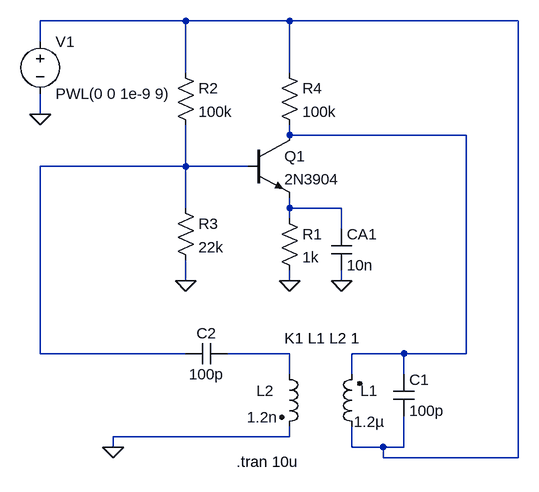
[diagram p0: schematic Barkhausen_ejemplo1_circuito.asc]
Barkhausen_ejemplo1_circuito.asc, the LTspice schematic file:
Version 4
SHEET 1 880 680
WIRE 48 -80 -176 -80
WIRE 208 -80 48 -80
WIRE 560 -80 208 -80
WIRE -176 -48 -176 -80
WIRE 48 0 48 -80
WIRE 208 0 208 -80
WIRE -176 64 -176 32
WIRE 208 96 208 80
WIRE 480 96 208 96
WIRE 48 144 48 80
WIRE 48 144 -176 144
WIRE 144 144 48 144
WIRE 48 208 48 144
WIRE 208 208 208 192
WIRE 288 208 208 208
WIRE 208 224 208 208
WIRE 288 240 288 208
WIRE 48 320 48 288
WIRE 208 320 208 304
WIRE 288 320 288 304
WIRE -176 432 -176 144
WIRE 48 432 -176 432
WIRE 208 432 112 432
WIRE 384 432 304 432
WIRE 480 432 480 96
WIRE 480 432 384 432
WIRE 208 464 208 432
WIRE 304 464 304 432
WIRE 384 464 384 432
WIRE 208 560 208 544
WIRE 208 560 -64 560
WIRE -64 576 -64 560
WIRE 304 576 304 544
WIRE 352 576 304 576
WIRE 384 576 384 528
WIRE 384 576 352 576
WIRE 352 592 352 576
WIRE 560 592 560 -80
WIRE 560 592 352 592
FLAG 208 320 0
FLAG 288 320 0
FLAG 48 320 0
FLAG -64 576 0
FLAG -176 64 0
SYMBOL npn 144 96 R0
SYMATTR InstName Q1
SYMATTR Value 2N3904
SYMBOL res 192 208 R0
SYMATTR InstName R1
SYMATTR Value 1k
SYMBOL cap 272 240 R0
SYMATTR InstName CA1
SYMATTR Value 10n
SYMBOL res 32 -16 R0
SYMATTR InstName R2
SYMATTR Value 100k
SYMBOL res 32 192 R0
SYMATTR InstName R3
SYMATTR Value 22k
SYMBOL cap 368 464 R0
SYMATTR InstName C1
SYMATTR Value 100p
SYMBOL ind2 320 560 R180
WINDOW 0 -24 71 Left 2
WINDOW 3 -34 23 Left 2
SYMATTR InstName L1
SYMATTR Value 1.2µ
SYMATTR Type ind
SYMBOL ind2 192 448 R0
WINDOW 0 -35 41 Left 2
WINDOW 3 -50 82 Left 2
SYMATTR InstName L2
SYMATTR Value 1.2n
SYMATTR Type ind
SYMBOL cap 112 416 R90
WINDOW 0 0 32 VBottom 2
WINDOW 3 32 32 VTop 2
SYMATTR InstName C2
SYMATTR Value 100p
SYMBOL res 192 -16 R0
SYMATTR InstName R4
SYMATTR Value 100k
SYMBOL voltage -176 -64 R0
WINDOW 123 0 0 Left 0
WINDOW 39 0 0 Left 0
SYMATTR InstName V1
SYMATTR Value PWL(0 0 1e-9 9)
TEXT 200 408 Left 2 !K1 L1 L2 1
TEXT 126 598 Left 2 !.tran 10u

The netlist it stands for:
* Barkhausen_ejemplo1_circuito.asc
Q1 N002 N003 N004 0 2N3904
R1 N004 0 1k
CA1 N004 0 10n
R2 N001 N003 100k
R3 N003 0 22k
C1 N002 N001 100p
L1 N001 N002 1.2µ
L2 N005 0 1.2n
C2 N005 N003 100p
R4 N001 N002 100k
V1 N001 0 PWL(0 0 1e-9 9)
.model NPN NPN
.model PNP PNP
.lib standard.bjt
K1 L1 L2 1
.tran 10u
.backanno
.end